# Altium schematic sheet downmixersB.SchDoc
size A4
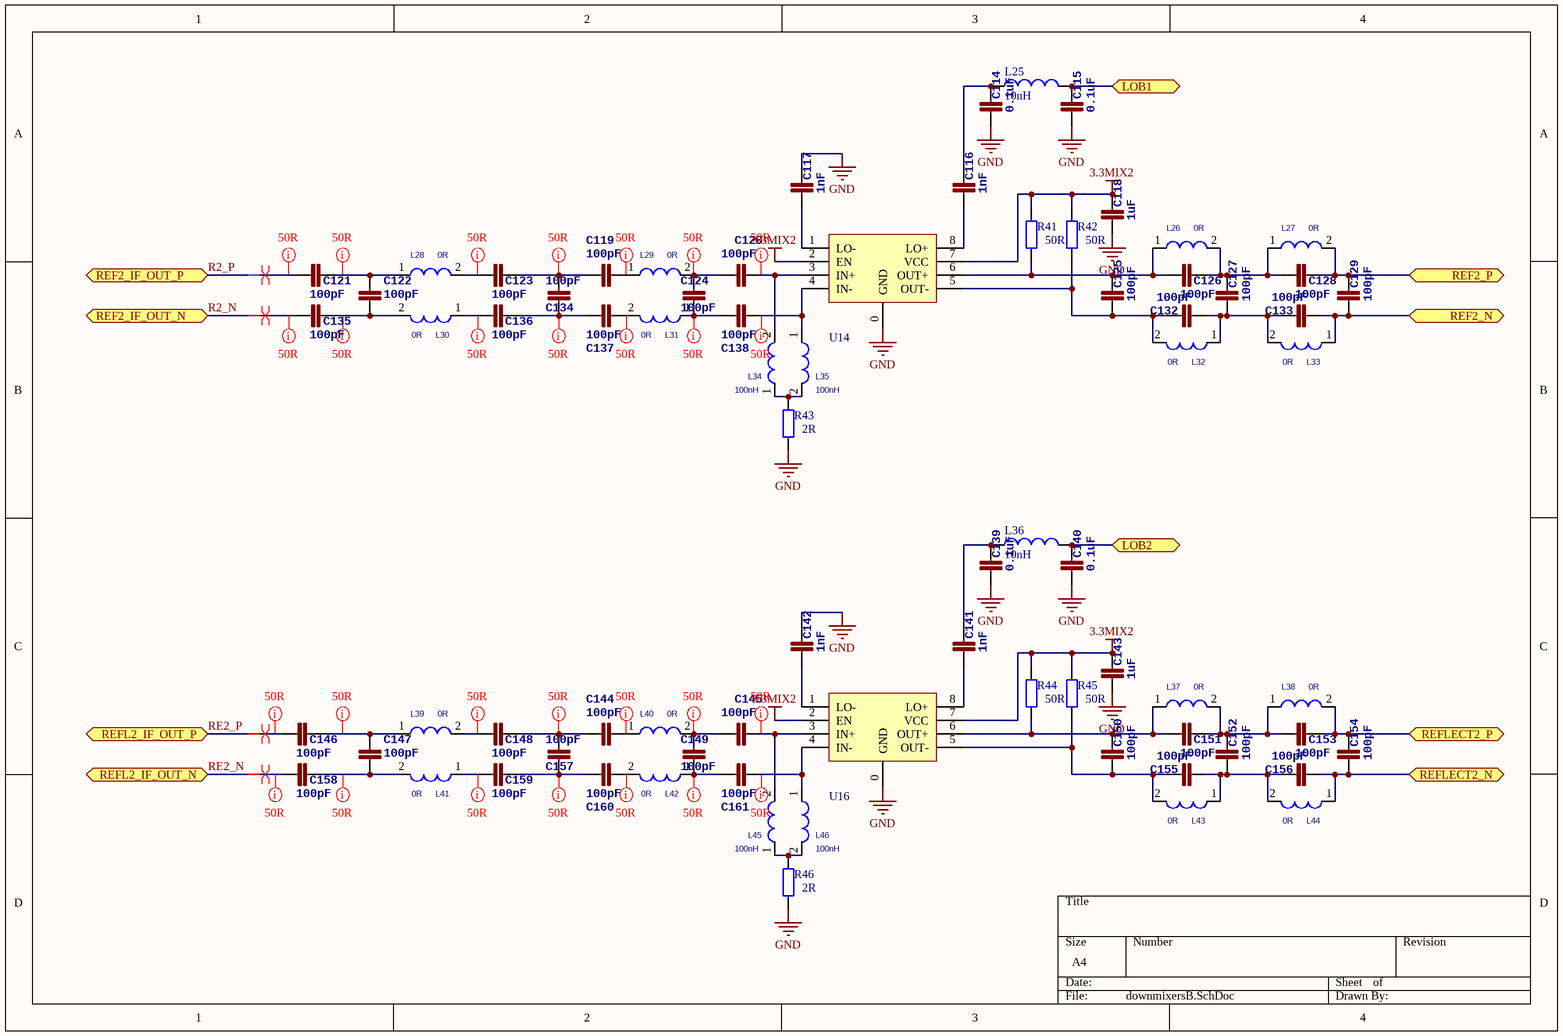
[diagram p0: downmixersB.SchDoc]

## Parts
C114  0.1uF  [0402]
C115  0.1uF  [0402]
C116  1nF  [0402]
C117  1nF  [0402]
C118  1uF  [0402]
C119  100pF  [0402]
C120  100pF  [0402]
C121  100pF  [0402]
C122  100pF  [0402]
C123  100pF  [0402]
C124  100pF  [0402]
C125  100pF  [0402]
C126  100pF  [0402]
C127  100pF  [0402]
C128  100pF  [0402]
C129  100pF  [0402]
C132  100pF  [0402]
C133  100pF  [0402]
C134  100pF  [0402]
C135  100pF  [0402]
C136  100pF  [0402]
C137  100pF  [0402]
C138  100pF  [0402]
C139  0.1uF  [0402]
C140  0.1uF  [0402]
C141  1nF  [0402]
C142  1nF  [0402]
C143  1uF  [0402]
C144  100pF  [0402]
C145  100pF  [0402]
C146  100pF  [0402]
C147  100pF  [0402]
C148  100pF  [0402]
C149  100pF  [0402]
C150  100pF  [0402]
C151  100pF  [0402]
C152  100pF  [0402]
C153  100pF  [0402]
C154  100pF  [0402]
C155  100pF  [0402]
C156  100pF  [0402]
C157  100pF  [0402]
C158  100pF  [0402]
C159  100pF  [0402]
C160  100pF  [0402]
C161  100pF  [0402]
L25  value 10nH  [0402]  (hidden comment: Inductor)
L26  0R  [0805]
L27  0R  [0805]
L28  0R  [0805]
L29  0R  [0805]
L30  0R  [0805]
L31  0R  [0805]
L32  0R  [0805]
L33  0R  [0805]
L34  100nH  [0402]
L35  100nH  [0402]
L36  value 10nH  [0402]  (hidden comment: Inductor)
L37  0R  [0805]
L38  0R  [0805]
L39  0R  [0805]
L40  0R  [0805]
L41  0R  [0805]
L42  0R  [0805]
L43  0R  [0805]
L44  0R  [0805]
L45  100nH  [0402]
L46  100nH  [0402]
R41  50R  [0402]
R42  50R  [0402]
R43  2R  [0402]
R44  50R  [0402]
R45  50R  [0402]
R46  2R  [0402]
U14  LT5560  [LT5560]  (value not drawn)
U16  LT5560  [LT5560]  (value not drawn)

## Ports
LOB1, LOB2, REF2_IF_OUT_N, REF2_IF_OUT_P, REF2_N, REF2_P, REFL2_IF_OUT_N, REFL2_IF_OUT_P, REFLECT2_N, REFLECT2_P

## Nets
3.3MIX2: C118.2 C143.2 R41.2 R42.2 R44.2 R45.2 U14.2(EN) U14.7(VCC) U16.2(EN) U16.7(VCC)
GND: C114.1 C115.1 C117.2 C118.1 C139.1 C140.1 C142.2 C143.1 R43.1 R46.1 U14.0(GND) U16.0(GND)
LOB1: C115.2 L25.2 ; port LOB1
LOB2: C140.2 L36.2 ; port LOB2
R2_N: C135.1 ; port REF2_IF_OUT_N
R2_P: C121.1 ; port REF2_IF_OUT_P
RE2_N: C158.1 ; port REFL2_IF_OUT_N
RE2_P: C146.1 ; port REFL2_IF_OUT_P
REF2_N: C129.1 C133.1 L33.1 ; port REF2_N
REF2_P: C128.2 C129.2 L27.2 ; port REF2_P
REFLECT2_N: C154.1 C156.1 L44.1 ; port REFLECT2_N
REFLECT2_P: C153.2 C154.2 L38.2 ; port REFLECT2_P
NetC114_2: C114.2 C116.2 L25.1
NetC116_1: C116.1 U14.8(LO+)
NetC117_1: C117.1 U14.1(LO-)
NetC119_1: C119.1 C123.2 C134.1
NetC119_2: C119.2 L29.1
NetC120_1: C120.1 C124.2 L29.2
NetC120_2: C120.2 L34.2 U14.3(IN+)
NetC121_2: C121.2 C122.2 L28.1
NetC122_1: C122.1 C135.2 L30.2
NetC123_1: C123.1 L28.2
NetC124_1: C124.1 C138.2 L31.1
NetC125_1: C125.1 C132.2 L32.2 R42.1 U14.5(OUT-)
NetC125_2: C125.2 C126.1 L26.1 R41.1 U14.6(OUT+)
NetC126_2: C126.2 C127.2 C128.1 L26.2 L27.1
NetC127_1: C127.1 C132.1 C133.2 L32.1 L33.2
NetC134_2: C134.2 C136.2 C137.2
NetC136_1: C136.1 L30.1
NetC137_1: C137.1 L31.2
NetC138_1: C138.1 L35.1 U14.4(IN-)
NetC139_2: C139.2 C141.2 L36.1
NetC141_1: C141.1 U16.8(LO+)
NetC142_1: C142.1 U16.1(LO-)
NetC144_1: C144.1 C148.2 C157.1
NetC144_2: C144.2 L40.1
NetC145_1: C145.1 C149.2 L40.2
NetC145_2: C145.2 L45.2 U16.3(IN+)
NetC146_2: C146.2 C147.2 L39.1
NetC147_1: C147.1 C158.2 L41.2
NetC148_1: C148.1 L39.2
NetC149_1: C149.1 C161.2 L42.1
NetC150_1: C150.1 C155.2 L43.2 R45.1 U16.5(OUT-)
NetC150_2: C150.2 C151.1 L37.1 R44.1 U16.6(OUT+)
NetC151_2: C151.2 C152.2 C153.1 L37.2 L38.1
NetC152_1: C152.1 C155.1 C156.2 L43.1 L44.2
NetC157_2: C157.2 C159.2 C160.2
NetC159_1: C159.1 L41.1
NetC160_1: C160.1 L42.2
NetC161_1: C161.1 L46.1 U16.4(IN-)
NetL34_1: L34.1 L35.2 R43.2
NetL45_1: L45.1 L46.2 R46.2

## Layout directives
net class 50R: NetC119_1, NetC119_2, NetC120_1, NetC120_2, NetC121_2, NetC122_1, NetC123_1, NetC124_1, NetC134_2, NetC136_1, NetC137_1, NetC138_1, NetC144_1, NetC144_2, NetC145_1, NetC145_2, NetC146_2, NetC147_1, NetC148_1, NetC149_1, NetC157_2, NetC159_1, NetC160_1, NetC161_1, R2_N, R2_P, RE2_N, RE2_P
differential pair: R2_N, R2_P, RE2_N, RE2_P

## Library data of the parts
C114-C129 C132-C161 = CAP0402-CAP: <b>Capacitor</b> / Standard 0603 ceramic capacitor, and 0.1" leaded capacitor.; PARTNO: CC0402ZRY5V7BB104
L25 L36 = Inductor: Code_IEC: 1005; Published: 8-Jun-2000; LatestRevisionDate: 29-May-2009; LatestRevisionNote: IPC-7351 Footprint Added.; PackageReference: 0402-A; Publisher: Altium Limited; PackageDescription: Chip Inductor; Code_JEITA: 0402
L26-L35 L37-L46 = L/2.5*2.0
R41-R46 = Res2: Resistor